# EAGLE design Nikon_PowerBoardV4 (EAGLE 7.3.0)
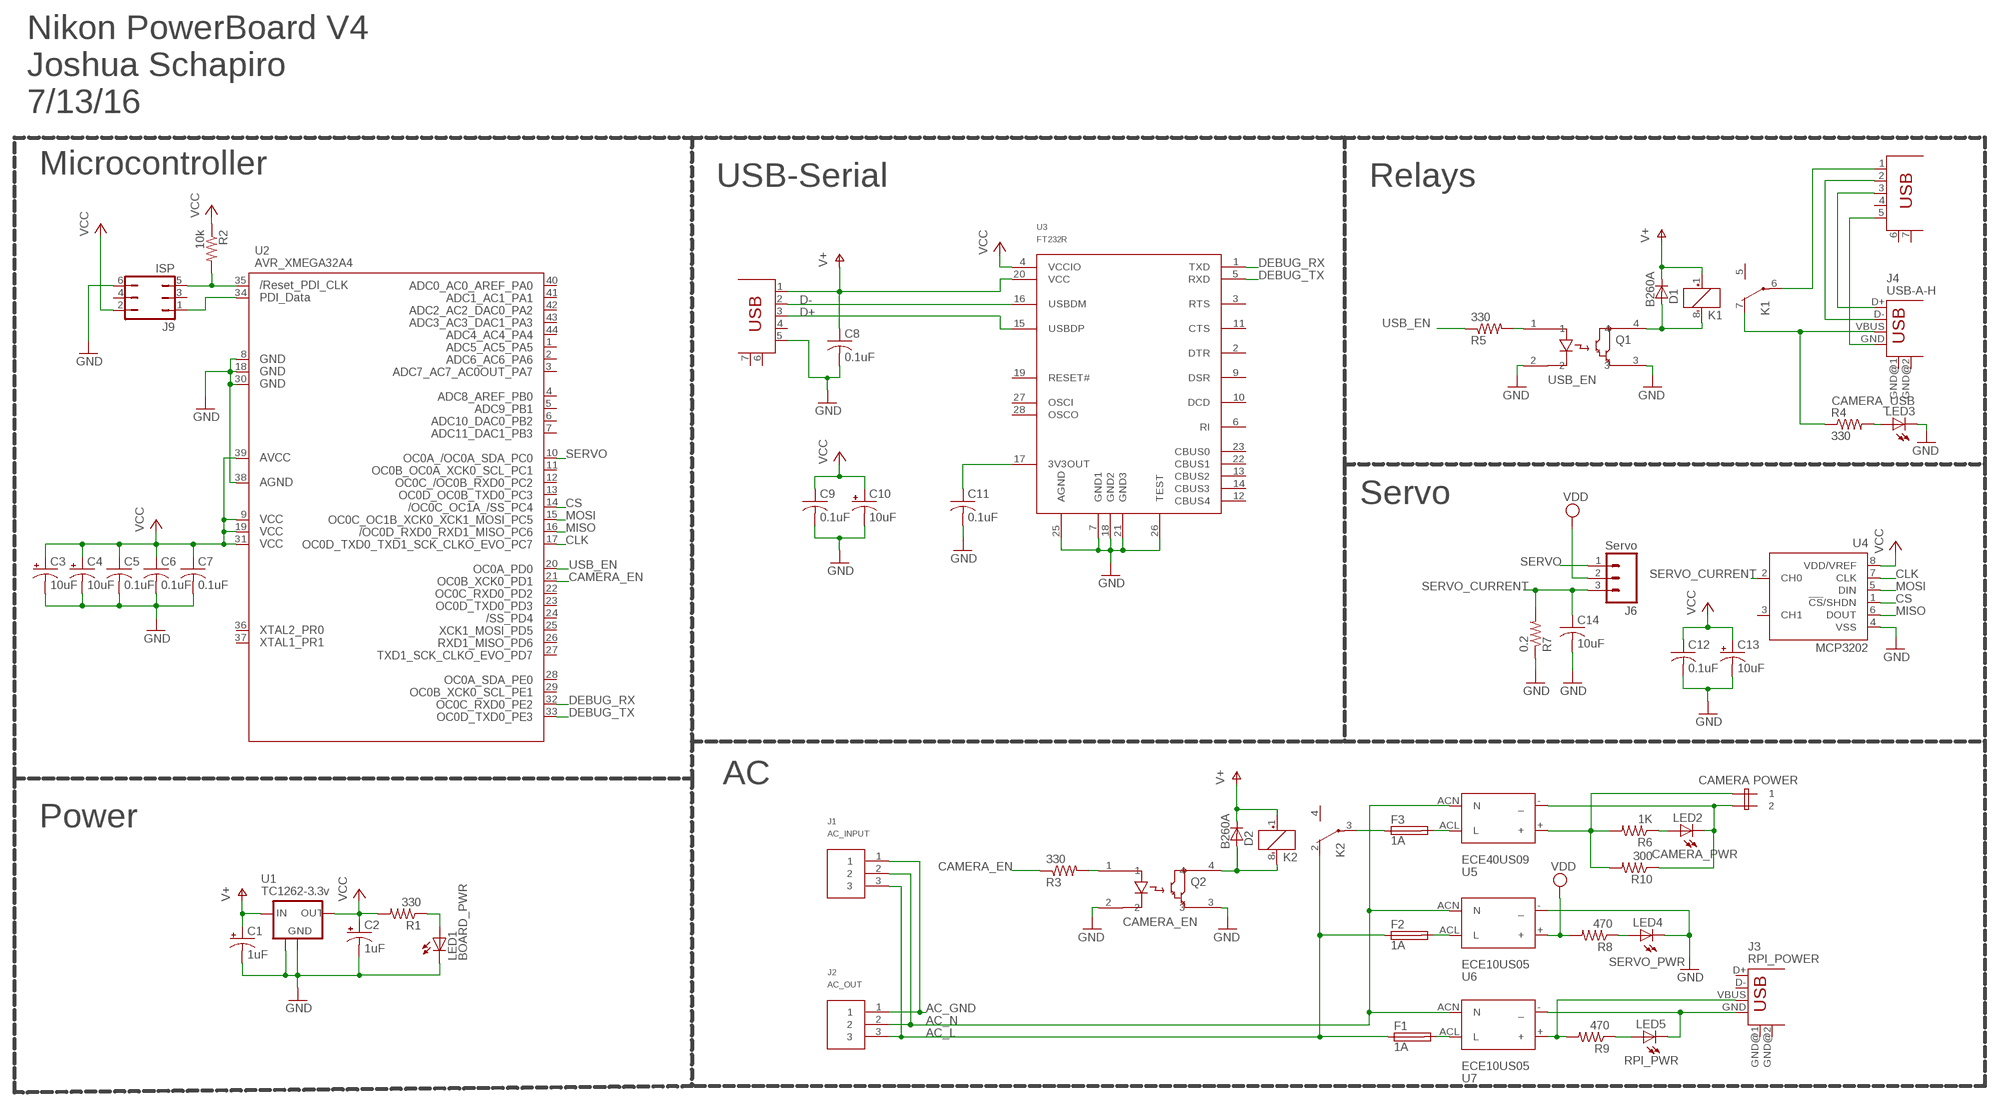
[diagram p0: schematic, sheet 1]

## Parts
C1  1uF  CAP_POL1206  [EIA3216]
C2  1uF  CAP_POL1206  [EIA3216]
C3  10uF  CAP_POL1206  [EIA3216]
C4  10uF  CAP_POL1206  [EIA3216]
C5  0.1uF  C-USC0603  [C0603]
C6  0.1uF  C-USC0603  [C0603]
C7  0.1uF  C-USC0603  [C0603]
C8  0.1uF  C-USC0603  [C0603]
C9  0.1uF  C-USC0603  [C0603]
C10  10uF  CAP_POL1206  [EIA3216]
C11  0.1uF  C-USC0603  [C0603]
C12  0.1uF  C-USC0603  [C0603]
C13  10uF  CAP_POL1206  [EIA3216]
C14  10uF  C-USC1206  [C1206]
D1  B260A  DIODESMA  [SMA-DIODE]
D2  B260A  DIODESMA  [SMA-DIODE]
F1  1A  19560  [19560]
F2  1A  19560  [19560]
F3  1A  19560  [19560]
J1  AC_INPUT  3-PIN-SCREW  [3-PIN-SCREW]
J2  AC_OUT  3-PIN-SCREW  [3-PIN-SCREW]
J3  RPI_POWER  USB-A-H  [USB-A-H]
J4  USB-A-H  [USB-A-H]
J5  CAMERA POWER  2-PIN_SCREWTERMINAL  [2-PIN_SCREWTERM]
J6  Servo  M03LONGPADS  [1X03_LONGPADS]
J7  MICRO-USB  MICRO-USBTO_SUPPORT  [MICRO_USB_SM_W/_TO_PINS]
J8  MICRO-USB  MICRO-USBTO_SUPPORT  [MICRO_USB_SM_W/_TO_PINS]
J9  ISP  JP3Q  [JP3Q]
K1  USB_EN  G6K-2F  [G6K-2F]
K2  CAMERA_EN  G6K-2F  [G6K-2F]
LED1  BOARD_PWR  LEDCHIPLED_0603  [CHIPLED_0603]
LED2  CAMERA_PWR  LEDCHIPLED_0603  [CHIPLED_0603]
LED3  CAMERA_USB  LEDCHIPLED_0603  [CHIPLED_0603]
LED4  SERVO_PWR  LEDCHIPLED_0603  [CHIPLED_0603]
LED5  RPI_PWR  LEDCHIPLED_0603  [CHIPLED_0603]
Q1  USB_EN  OPTOISOLATOR_SINGLE  [4-PIN_MINI-FLAT]
Q2  CAMERA_EN  OPTOISOLATOR_SINGLE  [4-PIN_MINI-FLAT]
R1  330  R-US_R0603  [R0603]
R2  10k  R-US_R0603  [R0603]
R3  330  R-US_R0603  [R0603]
R4  330  R-US_R0603  [R0603]
R5  330  R-US_R0603  [R0603]
R6  1K  R-US_R0603  [R0603]
R7  0.2  R-US_R1206  [R1206]
R8  470  R-US_R0603  [R0603]
R9  470  R-US_R0603  [R0603]
R10  300  R-US_R2512  [R2512]
U1  TC1262-3.3v  REGULATOR  [SOT223]
U2  AVR_XMEGA32A4  AVR_XMEGA_A4_44A  [TQFP44]
U3  FT232R  [SSOP28]
U4  MCP3202  MCP3202SN  [SO-08]
U5  ECE40US09  AC_DC_CONVERTERUS09  [EC40]
U6  ECE10US05  AC_DC_CONVERTERUS05  [ECE10]
U7  ECE10US05  AC_DC_CONVERTERUS05  [ECE10]

## Nets
AC_GND: J1.1 J2.1
AC_L: F1.1 F2.1 J1.3 J2.3 K2.2(2:O)
AC_N: J1.2 J2.2 U5.ACN(N) U6.ACN(N) U7.ACN(N)
CAMERA_EN: R3.1 U2.21(PD1)
CLK: U2.17(PC7) U4.7(CLK)
CS: U2.14(PC4) U4.1(!CS!/SHDN)
D+: J8.3(D+) U3.15(USBDP)
D-: J8.2(D-) U3.16(USBDM)
DEBUG_RX: U2.32(PE2) U3.1(TXD)
DEBUG_TX: U2.33(PE3) U3.5(RXD)
GND: C1.C(-) C2.C(-) C3.C(-) C4.C(-) C5.2 C6.2 C7.2 C8.2 C9.2 C10.C(-) C11.2 C12.2 C13.C(-) C14.2 J8.5(GND) J9.6 LED1.C LED3.C LED4.C Q1.2 Q1.3 Q2.2 Q2.3 R7.1 U1.2(GND) U1.4(GND1) U2.8(GND1) U2.18(GND2) U2.30(GND3) U2.38(AGND) U3.7(GND1) U3.18(GND2) U3.21(GND3) U3.25(AGND) U3.26(TEST) U4.4(VSS) U6.-(_)
MISO: U2.16(PC6) U4.6(DOUT)
MOSI: U2.15(PC5) U4.5(DIN)
N$1: J9.1 U2.34(PDI_DATA)
N$2: J4.GND J7.5(GND)
N$3: F3.1 K2.3(2:P)
N$4: LED1.A R1.1
N$5: Q1.1 R5.2
N$6: J9.5 R2.2 U2.35(RESET)
N$7: D2.A K2.8(1:-) Q2.4
N$8: J7.1(VBUS) K1.6(3:P)
N$10: LED3.A R4.2
N$11: Q2.1 R3.2
N$12: J3.VBUS R9.2 U7.+
N$13: F3.2 U5.ACL(L)
N$14: F2.2 U6.ACL(L)
N$15: F1.2 U7.ACL(L)
N$16: LED4.A R8.1
N$17: J5.P$1 R6.2 R10.2 U5.+
N$18: C11.1 U3.17(3V3OUT)
N$19: LED2.A R6.1
N$20: J5.P$2 LED2.C R10.1 U5.-(_)
N$21: J3.GND LED5.C U7.-(_)
N$22: LED5.A R9.1
N$23: J4.VBUS K1.7(3:O) R4.1
N$90: J4.D+ J7.3(D+)
N$100: J4.D- J7.2(D-)
N$180: D1.A K1.8(1:-) Q1.4
SERVO: J6.1 U2.10(PC0)
SERVO_CURRENT: C14.1 J6.3 R7.2 U4.2(CH0)
USB_EN: R5.1 U2.20(PD0)
V+: C1.A(+) C8.1 D1.C D2.C J8.1(VBUS) K1.1(1:+) K2.1(1:+) U1.1(IN) U3.20(VCC)
VCC: C2.A(+) C3.A(+) C4.A(+) C5.1 C6.1 C7.1 C9.1 C10.A(+) C12.1 C13.A(+) J9.2 R1.2 R2.1 U1.3(OUT) U2.9(VCC1) U2.19(VCC2) U2.31(VCC3) U2.39(AVCC) U3.4(VCCIO) U4.8(VDD/VREF)
VDD: J6.2 R8.2 U6.+
Unconnected: J3.D+ J3.D- J3.GND@1(GND) J3.GND@2(GND) J4.GND@1(GND) J4.GND@2(GND) J7.4(ID) J7.6(MTN3) J7.7(MTN4) J8.4(ID) J8.6(MTN3) J8.7(MTN4) J9.3 J9.4 K1.2(2:O) K1.3(2:P) K1.4(2:S) K1.5(3:S) K2.4(2:S) K2.5(3:S) K2.6(3:P) K2.7(3:O) U2.1(PA5) U2.2(PA6) U2.3(PA7) U2.4(PB0) U2.5(PB1) U2.6(PB2) U2.7(PB3) U2.11(PC1) U2.12(PC2) U2.13(PC3) U2.22(PD2) U2.23(PD3) U2.24(PD4) U2.25(PD5) U2.26(PD6) U2.27(PD7) U2.28(PE0) U2.29(PE1) U2.36(PR0) U2.37(PR1) U2.40(PA0) U2.41(PA1) U2.42(PA2) U2.43(PA3) U2.44(PA4) U3.2(DTR) U3.3(RTS) U3.6(RI) U3.9(DSR) U3.10(DCD) U3.11(CTS) U3.12(CBUS4) U3.13(CBUS2) U3.14(CBUS3) U3.19(RESET#) U3.22(CBUS1) U3.23(CBUS0) U3.27(OSCI) U3.28(OSCO) U4.3(CH1)

## Notes on the sheet
- Nikon PowerBoard V4
  Joshua Schapiro
  7/13/16
- Microcontroller
- USB-Serial | Relays
- Servo
- AC | CAMERA POWER
- Power

## Library data of the parts
C1-C4 C10 C13 = SparkFun:CAP_POL: Capacitor Polarized These are standard SMD and PTH capacitors. Normally 10uF, 47uF, and 100uF in electrolytic and tantalum varieties. Always verify the external diameter of the through hole cap, it varies with capacity, voltage, and manufacturer. The EIA devices should be standard.
C5 = rcl:C-US: CAPACITOR, American symbol
C6-C9 C11 C12 C14 = resistor:C-US: CAPACITOR, American symbol
D1 D2 = SparkFun:DIODE: Diode These are standard reverse protection diodes and small signal diodes. SMA package can handle up to about 1A. SOD-323 can handle about 200mA. What the SOD-323 package when ordering, there are some mfgs out there that are 5-pin packages.
F1-F3 = fuse:19560: FUSE HOLDER TR5, Wickmann
J1 J2 = Josh:3-PIN-SCREW
J3 J4 = GadgetOne:USB: USB Connectors
J5 = Josh:2-PIN_SCREWTERMINAL
J6 = SparkFun:M03: Header 3 Standard 3-pin 0.1" header. Use with straight break away headers (SKU : PRT-00116), right angle break away headers (PRT-00553), swiss pins (PRT-00743), machine pins (PRT-00117), and female headers (PRT-00115). Molex polarized connector foot print use with SKU : PRT-08232 with associated crimp pins and housings.
J7 J8 = Josh:MICRO-USB
J9 = jumper:JP3Q: JUMPER
K1 K2 = relay:G6K: Low Signal Relay oeiwcsnts1.omron.com/.. D20G6K0100.pdf
LED1-LED5 = led:LED: LED OSRAM: - CHIPLED LG R971, LG N971, LY N971, LG Q971, LY Q971, LO R971, LY R971 LH N974, LH R974 LS Q976, LO Q976, LY Q976 LO Q996 - Hyper CHIPLED LW Q18S LB Q993, LB Q99A, LB R99A - SideLED LS A670, LO A670, LY A670, LG A670, LP A670 LB A673, LV A673, LT A673, LW A673 LH A674 LY A675 LS A676, LA A676, LO A676, LY A676, LW A676 LS A679, LY A679, LG A679 - Hyper Micro SIDELED® LS Y876, LA Y876, LO Y876, LY Y876 LT Y87S - SmartLED LW L88C, LW L88S LB L89C, LB L89S, LG L890 LS L89K, LO L89K, LY L89K LS L896, LA L896, LO L896, LY L896 - TOPLED LS T670, LO T670, LY T670, LG T670, LP T670 LSG T670, LSP T670, LSY T670, LOP T670, LYG T670 LG T671, LOG T671, LSG T671 LB T673, LV T673, LT T673, LW T673 LH T674 LS T676, LA T676, LO T676, LY T676, LB T676, LH T676, LSB T676, LW T676 LB T67C, LV T67C, LT T67C, LS T67K, LO T67K, LY T67K, LW E67C LS E67B, LA E67B, LO E67B, LY E67B, LB E67C, LV E67C, LT E67C LW T67C LS T679, LY T679, LG T679 LS T770, LO T770, LY T770, LG T770, LP T770 LB T773, LV T773, LT T773, LW T773 LH T774 LS E675, LA E675, LY E675, LS T675 LS T776, LA T776, LO T776, LY T776, LB T776 LHGB T686 LT T68C, LB T68C - Hyper Mini TOPLED® LB M676 - Mini TOPLED Santana® LG M470 LS M47K, LO M47K, LY M47K Source: http://www.osram.convergy.de LUXEON: - LUMILED® LXK2-PW12-R00, LXK2-PW12-S00, LXK2-PW14-U00, LXK2-PW14-V00 LXK2-PM12-R00, LXK2-PM12-S00, LXK2-PM14-U00 LXK2-PE12-Q00, LXK2-PE12-R00, LXK2-PE12-S00, LXK2-PE14-T00, LXK2-PE14-U00 LXK2-PB12-K00, LXK2-PB12-L00, LXK2-PB12-M00, LXK2-PB14-N00, LXK2-PB14-P00, LXK2-PB14-Q00 LXK2-PR12-L00, LXK2-PR12-M00, LXK2-PR14-Q00, LXK2-PR14-R00 LXK2-PD12-Q00, LXK2-PD12-R00, LXK2-PD12-S00 LXK2-PH12-R00, LXK2-PH12-S00 LXK2-PL12-P00, LXK2-PL12-Q00, LXK2-PL12-R00 Source: www.luxeon.com KINGBRIGHT: KA-3528ASYC Source: www.kingbright.com
Q1 Q2 = Josh:OPTOISOLATOR_SINGLE: Digikey: 425-2098-1-ND If = 10ma Ic = 80ma
R1-R6 R8-R10 = resistor:R-US_: RESISTOR, American symbol
R7 = rcl:R-US_: RESISTOR, American symbol
U1 = GadgetOne:REGULATOR: VOLTAGE REGULATOR, see: http://focus.ti.com/lit/ds/symlink/ua78m05.pdf
U2 = xmega:AVR_XMEGA_A4_: Device for Atmel AVR XMEGA A4 Series
U3 = gadgetry:FT232R
U4 = microchip:MCP3202: 2.7V Dual Channel 12-Bit A/D Converter with SPI Serial Interface Source: http://ww1.microchip.com/downloads/en/DeviceDoc/21034D.pdf
U5-U7 = Josh:AC_DC_CONVERTER

## Net classes
4 xxwide: width 0.203 mm

## Board
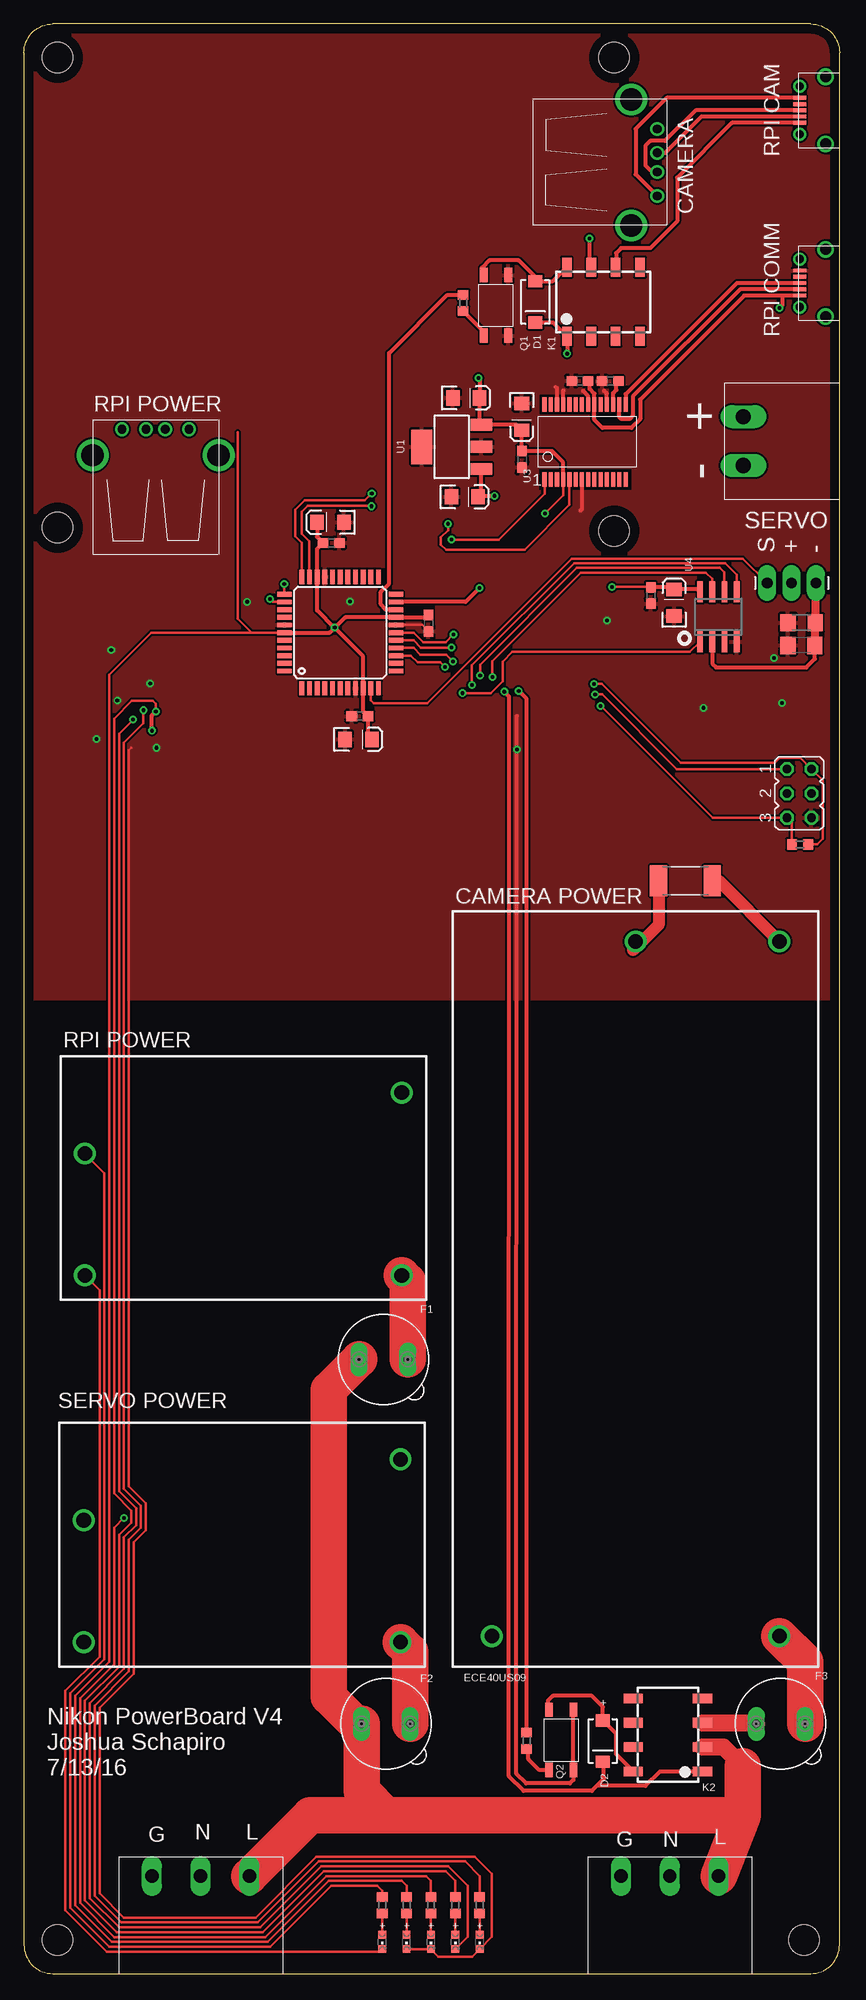
[diagram p1: board, top side]
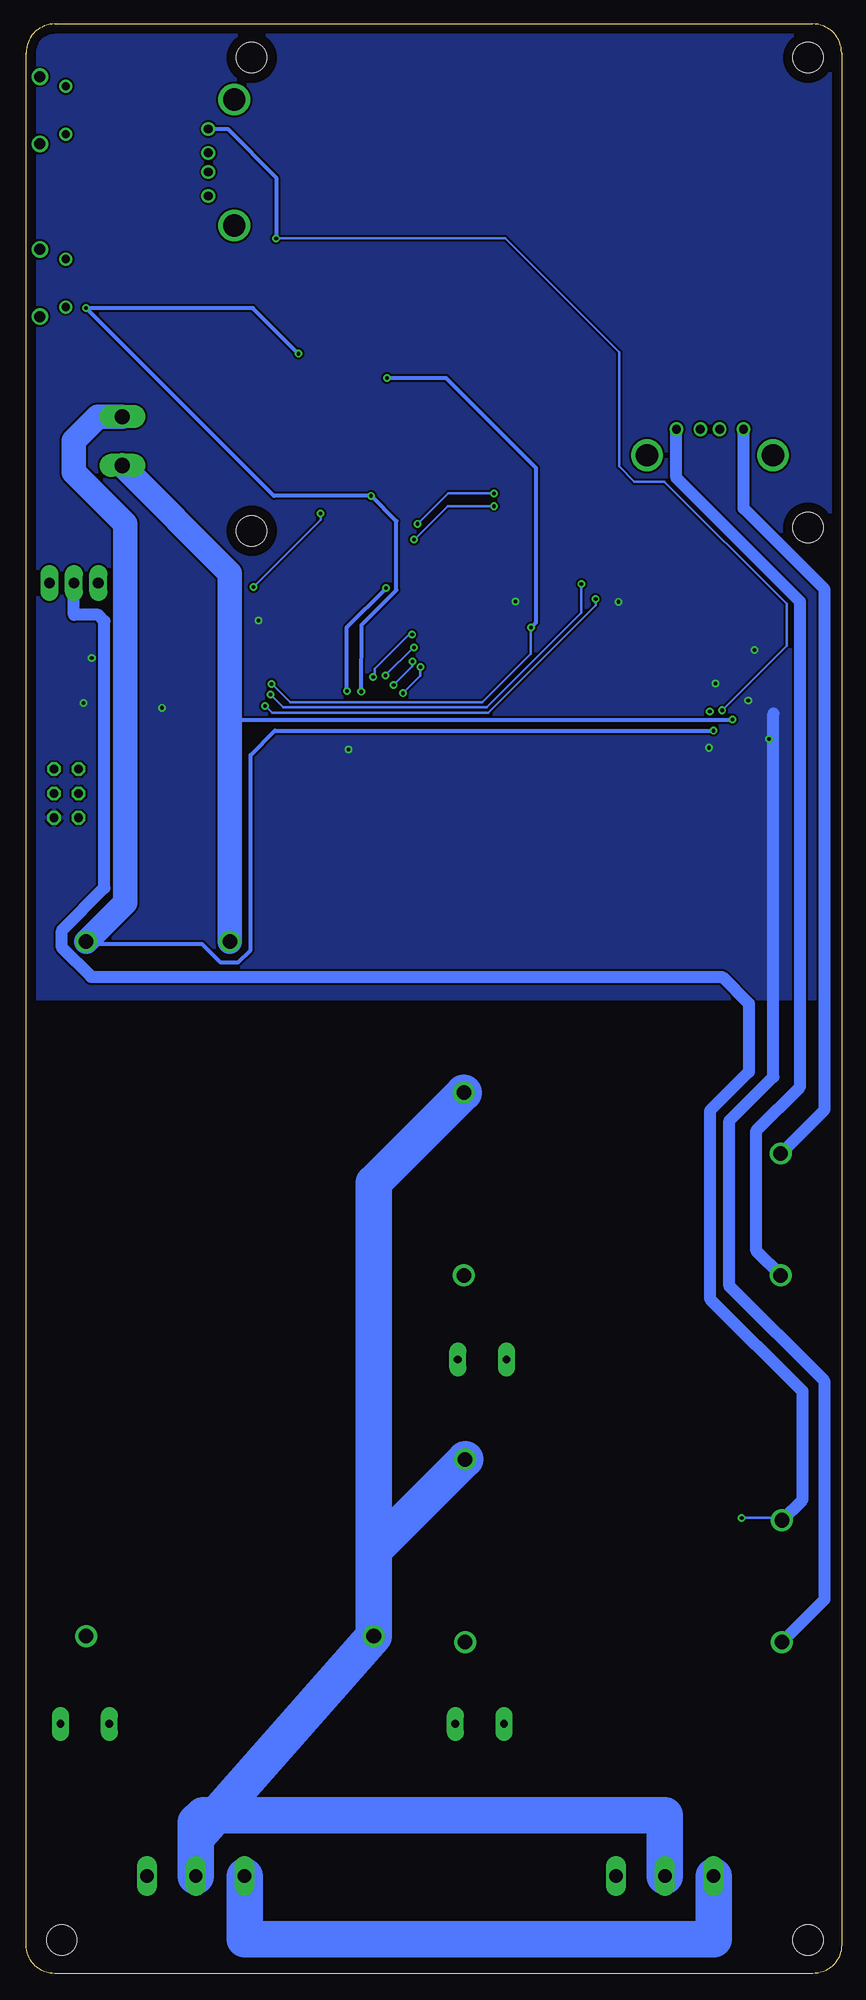
[diagram p2: board, bottom side, seen from below]

Size 85 x 203.2 mm. Coordinates in mm from the lower left corner, seen from the top.
Outline: 3,0 82,0 arc90 85,3 85,200.2 arc90 82,203.2 3,203.2 arc90 0,200.2 0,3 arc90 3,0
Copper layers (1*16): Top 0.035mm / dielectric 1.5mm / Bottom 0.035mm
Design rules "default *": minimum track width 6mil, minimum drill 15mil, track to track 8mil, track to pad 8mil, pad to pad 8mil, via to via 8mil, smd to smd 8mil, copper to edge 40mil, drill to drill 8mil, minimum pad ring 10mil, minimum via ring 8mil, stop-mask expansion 4mil, vias tented up to drill 0mil, thermal gap 10mil
Holes 3.17 mm at 3.5,199.7 61.5,150.38 3.5,150.7 61.5,199.7 3.5,3.5 81.28,3.5
tRestrict: area 53.7,162.5 to 63.2,164.6; area 53.7,154.6 to 63.3,156.8

### Footprints (pad centres in the part's own frame; a part is rotated, then mirrored left to right if it is on the bottom)
EIA3216 = smd 1.4 x 1.6: A 1.4,0; C -1.4,0
C0603 = smd 1.1 x 1: 1 -0.85,0; 2 0.85,0
C1206 = smd 1.6 x 1.8: 1 -1.4,0; 2 1.4,0
SMA-DIODE = smd 1.27 x 1.47: A -2.15,0; C 2.15,0
19560 = drill 0.813 pad 1.778 long: 1 -2.54,0; 2 2.54,0
3-PIN-SCREW = drill 1.397 long: 1 -5.08,10.16; 2 0,10.16; 3 5.08,10.16
USB-A-H = drill 0.914: D+ 2.718,-1.003; D- 2.718,1.003; GND 2.718,-3.493; VBUS 2.718,3.493 | drill 2.311: GND@1 0,6.566; GND@2 0,-6.566
2-PIN_SCREWTERM = drill 1.6 long: P$1 -2.54,0; P$2 2.54,0
1X03_LONGPADS = drill 1.118 pad 1.88 long: 1 0,0; 2 2.54,0; 3 5.08,0
MICRO_USB_SM_W/_TO_PINS = smd 0.4 x 1.35: 1 -1.3,4.15; 2 -0.65,4.15; 3 0,4.15; 4 0.65,4.15; 5 1.3,4.15 | drill 1.15: 6 -3.5,1.45; 7 3.5,1.45 | drill 0.85: P$1 -2.5,4.15; P$2 2.5,4.15
JP3Q = drill 0.914 octagon: 1 -2.54,-1.27; 2 -2.54,1.27; 3 0,-1.27; 4 0,1.27; 5 2.54,-1.27; 6 2.54,1.27
G6K-2F = smd 1 x 2: 1 -3.81,-3.6; 2 -1.27,-3.6; 3 1.27,-3.6; 4 3.81,-3.6; 5 3.81,3.6; 6 1.27,3.6; 7 -1.27,3.6; 8 -3.81,3.6
CHIPLED_0603 = smd 0.8 x 0.8: A 0,-0.75; C 0,0.75
4-PIN_MINI-FLAT = smd 1.5 x 0.8: 1 -3.15,1.27; 2 -3.15,-1.27; 3 3.15,-1.27; 4 3.15,1.27
R0603 = smd 1 x 1.1: 1 -0.85,0; 2 0.85,0
R1206 = smd 1.6 x 1.803: 1 -1.422,0; 2 1.422,0
R2512 = smd 1.8 x 3.2: 1 -2.8,0; 2 2.8,0
SOT223 = smd 1.219 x 2.235: 1 -2.311,-3.099; 2 0,-3.099; 3 2.311,-3.099 | smd 3.6 x 2.2: 4 0,3.099
TQFP44 = smd 1.5 x 0.5: 1 -5.8,4; 2 -5.8,3.2; 3 -5.8,2.4; 4 -5.8,1.6; 5 -5.8,0.8; 6 -5.8,0; 7 -5.8,-0.8; 8 -5.8,-1.6; 9 -5.8,-2.4; 10 -5.8,-3.2; 11 -5.8,-4; 23 5.8,-4; 24 5.8,-3.2; 25 5.8,-2.4; 26 5.8,-1.6; 27 5.8,-0.8; 28 5.8,0; 29 5.8,0.8; 30 5.8,1.6; 31 5.8,2.4; 32 5.8,3.2; 33 5.8,4 | smd 0.5 x 1.5: 12 -4,-5.8; 13 -3.2,-5.8; 14 -2.4,-5.8; 15 -1.6,-5.8; 16 -0.8,-5.8; 17 0,-5.8; 18 0.8,-5.8; 19 1.6,-5.8; 20 2.4,-5.8; 21 3.2,-5.8; 22 4,-5.8; 34 4,5.8; 35 3.2,5.8; 36 2.4,5.8; 37 1.6,5.8; 38 0.8,5.8; 39 0,5.8; 40 -0.8,5.8; 41 -1.6,5.8; 42 -2.4,5.8; 43 -3.2,5.8; 44 -4,5.8
SSOP28 = smd 0.425 x 1.5: 1 0.65,-1.3; 2 1.3,-1.3; 3 1.95,-1.3; 4 2.6,-1.3; 5 3.25,-1.3; 6 3.9,-1.3; 7 4.55,-1.3; 8 5.2,-1.3; 9 5.85,-1.3; 10 6.5,-1.3; 11 7.15,-1.3; 12 7.8,-1.3; 13 8.45,-1.3; 14 9.1,-1.3; 15 9.1,6.5; 16 8.45,6.5; 17 7.8,6.5; 18 7.15,6.5; 19 6.5,6.5; 20 5.85,6.5; 21 5.2,6.5; 22 4.55,6.5; 23 3.9,6.5; 24 3.25,6.5; 25 2.6,6.5; 26 1.95,6.5; 27 1.3,6.5; 28 0.65,6.5
SO-08 = smd 0.6 x 2.2: 1 -1.905,-2.6; 2 -0.635,-2.6; 3 0.635,-2.6; 4 1.905,-2.6; 5 1.905,2.6; 6 0.635,2.6; 7 -0.635,2.6; 8 -1.905,2.6
EC40 = drill 1.524: + 36.195,-14.986; - 36.195,0; ACL -36.195,-14.986; ACN -36.195,14.986
ECE10 = drill 1.524: + 16.51,-2.54; - 16.51,10.16; ACL -16.51,10.16; ACN -16.51,-8.89

### Placement (x,y rotation side)
C1  45.94,153.92 0 top
C2  46.09,164.23 0 top
C3  34.86,128.64 0 top
C4  31.94,151.27 180 top
C5  42.15,140.75 270 top
C6  32.02,149.11 0 top
C7  35.01,131.05 180 top
C8  57.95,166 180 top
C9  51.91,157.83 270 top
C10  51.88,162.25 270 top
C11  61.1,165.98 180 top
C12  65.34,143.64 270 top
C13  67.76,142.87 90 top
C14  81.03,138.43 180 top
D1  53.28,174.24 270 top
D2  60.33,24.23 270 top
F1  37.47,64.01 0 top
F2  37.72,26.04 0 top
F3  78.87,26.04 0 top
J1  67.31,0 0 top
J2  18.41,0 0 top
J3  13.72,158.24 90 top
J4  63.29,188.77 0 top
J5  74.97,159.73 270 top
J6  77.47,144.94 0 top
J7  85,194.2 90 top
J8  85,176.2 90 top
J9  80.81,123 270 top
K1  60.4,174.24 0 top
K2  67.11,24.87 90 top
LED1  39.88,3.3 180 top
LED2  44.96,3.3 180 top
LED3  47.5,3.3 180 top
LED4  42.42,3.3 180 top
LED5  37.34,3.3 180 top
Q1  49.2,173.87 90 top
Q2  56,24.35 90 top
R1  39.88,7.11 90 top
R2  80.89,117.69 180 top
R3  52.39,24.27 270 top
R4  47.5,7.11 270 top
R5  45.78,174.12 270 top
R6  44.96,7.11 90 top
R7  81.05,140.8 0 top
R8  42.42,7.11 90 top
R9  37.34,7.11 90 top
R10  68.94,113.89 0 top
U1  44.57,159.13 90 top
U2  32.96,139.76 90 top
U3  53.61,157.02 0 top
U4  72.37,141.41 0 top
U5  63.75,71.37 90 top
U6  22.73,44.7 180 top
U7  22.86,82.93 180 top

### Tracks (layer width: path | path; a pad name or v marks a point on that pad's centre or on a via)
AC_GND
  Bottom 3.81: J1.1 62.23,3.56 13.34,3.56 J2.1
AC_L
  Top 1.778: 74.93,21.59 72.92,23.6 K2.2
  Top 3.81: J1.3 74.93,16.51 | 74.93,16.51 37.72,16.51 | 74.93,16.51 74.93,21.59 | F2.1 35.18,25.4 | 35.18,25.4 35.18,19.05 37.72,16.51 | F1.1 31.75,60.83 31.75,28.83 35.18,25.4 | J2.3 29.84,16.51 37.72,16.51
AC_N
  Bottom 3.81: J2.2 18.41,16.51 66.55,16.51 67.31,15.75 J1.2 67.31,14.1 U5.ACN | U6.ACN 48.77,44.07 U5.ACN | U7.ACN 48.77,82.42 U5.ACN
CAMERA_EN  (via drill 0.38)
  Top 0.406: R3.1 52.39,132.85 v51.56,133.68 | v47.47,144.4 46.04,142.96 U2.21
  Bottom 0.406: v51.56,133.68 51.56,140.31 v47.47,144.4
CLK  (via drill 0.38)
  Top 0.254: U4.7 71.74,145.36 71.07,146.03 58.04,146.03 48.82,136.8 v48.82,135.15 | U2.17 40.63,139.76 41.63,138.76 43.94,138.76 v44.76,139.57
  Bottom 0.254: v44.76,139.57 45.09,139.57 48.64,136.02 48.64,135.33 v48.82,135.15
CS  (via drill 0.38)
  Top 0.254: U2.14 40.31,137.36 41.02,136.65 43.41,136.65 v43.89,136.17 | v45.72,133.45 48.64,133.45 49.89,134.7 49.89,136.75 50.88,137.74 69.4,137.74 U4.1
  Bottom 0.254: v43.89,136.17 43.89,135.28 v45.72,133.45
D+
  Top 0.406: J8.3 74.3,176.2 62.7,164.61 U3.15
D-
  Top 0.406: J8.2 74.64,175.55 63.48,164.39 63.48,162.38 63.12,162.03 62.26,162.03 62.05,162.23 U3.16
DEBUG_RX  (via drill 0.38)
  Top 0.254: U2.32 29.76,149.29 28.96,150.09 28.96,152.38 29.57,152.98 36.17,152.98 v36.22,152.93 | v44.55,149.45 49.48,149.45 54.26,154.23 U3.1
  Bottom 0.254: v36.22,152.93 41.07,152.93 v44.55,149.45
DEBUG_TX  (via drill 0.38)
  Top 0.254: U2.33 28.96,149.15 28.3,149.81 28.3,152.55 29.29,153.54 35.51,153.54 v36.25,154.28 | v44.2,151.1 44.2,150.42 43.46,149.68 43.46,148.95 43.99,148.41 52.17,148.41 56.85,153.1 U3.5
  Bottom 0.254: v36.25,154.28 41.02,154.28 v44.2,151.1
GND  (via drill 0.38)
  Top 0.254: LED1.C LED4.C 43.18,1.78 46.72,1.78 LED3.C 48.77,3.82 48.77,10.41 46.99,12.19 30.48,12.19 24.13,5.84 10.41,5.84 7.87,8.38 7.87,27.69 11.43,31.24 11.43,44.96 12.7,46.23 12.7,49.02 10.92,50.8 10.92,127.51 11.18,127.76 | U2.18 41.49,140.56 C5.2
  Top 0.406: Q2.3 Q2.2 57.27,20.19 56.9,19.81 52.32,19.81 51.31,20.83 51.38,131.09 | U3.18 60.76,164.69 60.45,165 | U3.26 55.55,165.22 55.4,165.38 | U3.25 56.2,164.99 56.24,165.02 | U3.21 58.8,164.41 58.27,164.95 | U3.7 58.16,152.64 57.99,152.48
  Bottom 1.27: U6.- 1.78,38.99 1.78,61.72 11.68,71.63 11.68,88.9 7.11,93.47 7.11,131.32
  other vias: 13.82,127.76 7.57,128.68 13.16,134.47 23.27,142.98 33.99,143 9.09,137.95 9.73,132.69 51.38,127.58 60.76,141.02 70.84,131.93 79.02,132.44 78.16,137.11
  pour Bottom: 0,101.6 85,101.6 85,203.2 0,203.2
  pour Top: 0,203.2 85,203.2 85,101.6 0,101.6
MISO  (via drill 0.38)
  Top 0.254: U4.6 73.01,146.04 72.54,146.51 57.63,146.51 47.55,136.42 v47.55,135.31 | U2.16 40.62,138.96 41.38,138.2 v44.55,138.2
  Bottom 0.254: v47.55,135.31 44.65,138.2 v44.55,138.2
MOSI  (via drill 0.38)
  Top 0.254: U4.5 74.28,145.81 73.1,146.99 57.33,146.99 46.69,136.35 v46.69,134.31 | U2.15 40.63,138.16 41.33,137.47 44.02,137.47 v44.73,136.75
  Bottom 0.254: v46.69,134.31 44.73,136.27 v44.73,136.75
N$1  (via drill 0.38)
  Top 0.254: U2.34 27.13,143.79 v27.13,144.83 | v59.54,133.32 60.25,133.32 68.03,125.54 J9.1
  Bottom 0.254: v27.13,144.83 27.13,141.86 37.01,131.98 58.19,131.98 v59.54,133.32
N$2
  Top 0.406: J7.5 66.98,195.5 63.75,192.28 63.75,187.53 J4.GND
N$3
  Top 1.778: K2.3 76.22,26.14 F3.1
N$4
  Top 0.254: R1.1 LED1.A
N$5
  Top 0.406: Q1.1 47.93,171.12 R5.2
N$6  (via drill 0.38)
  Top 0.254: R2.2 80.04,119.96 J9.5 71.77,120.46 v60.1,132.13 | U2.35 25.92,142.96 v25.63,143.26
  Bottom 0.254: v25.63,143.26 25.63,142.6 36.83,131.39 59.36,131.39 v60.1,132.13
N$7
  Top 0.406: K2.8 61.72,22.86 61.72,24.98 D2.A 60.33,27.81 59.18,28.96 55.12,28.96 54.61,28.45 54.61,27.62 Q2.4
N$8
  Top 0.406: J7.1 73.77,192.9 68.07,187.2 68.07,182.63 65.28,179.83 62.23,179.83 61.72,179.32 61.72,177.9 K1.6
N$10
  Top 0.254: R4.2 LED3.A
N$11
  Top 0.406: Q2.1 53.73,21.2 52.58,22.35 52.58,23.24 R3.2
N$12
  Top 0.254: R9.2 37.34,8.64 36.83,9.14 32,9.14 25.65,2.79 8.89,2.79 4.83,6.86 4.83,29.21 8.38,32.77 8.38,83.44 U7.+
  Bottom 1.27: U7.+ 1.78,90.04 1.78,144.27 10.22,152.72 J3.VBUS
N$13
  Top 3.81: F3.2 81.41,32.51 U5.ACL
N$14
  Top 3.81: F2.2 40.26,33.53 U6.ACL
N$15
  Top 3.81: F1.2 40.01,72.14 U7.ACL
N$16
  Top 0.254: R8.1 LED4.A
N$17  (via drill 0.38)
  Top 0.254: R6.2 44.96,9.65 43.94,10.67 31.24,10.67 24.89,4.32 9.65,4.32 6.35,7.62 6.35,28.45 9.91,32 9.91,45.72 11.18,46.99 11.18,48.26 9.4,50.04 9.4,130.81 11.25,132.66 13.41,132.66 13.74,132.33 v13.74,131.55
  Top 0.406: v13.34,129.54 13.34,131.14 v13.74,131.55
  Top 1.27: R10.2 72.42,113.89 U5.+
  Bottom 0.406: v13.34,129.54 59.05,129.54 61.59,127 61.59,106.68 62.87,105.41 64.77,105.41 66.67,107.31 78.49,107.31 U5.+
  Bottom 2.54: U5.+ 74.68,111.63 74.68,151.13 80.01,156.46 80.01,159.77 77.51,162.27 J5.P$1
N$18
  Top 0.406: U3.17 61.41,164.73 61.75,165.07 61.75,165.78 C11.1
N$19
  Top 0.254: R6.1 LED2.A
N$20  (via drill 0.38)
  Top 0.254: LED2.C 46.23,3.82 46.23,9.14 44.2,11.18 30.99,11.18 24.64,4.83 9.91,4.83 6.86,7.87 6.86,28.19 10.41,31.75 10.41,45.47 11.68,46.74 11.68,48.51 9.91,50.29 9.91,129.24 v11.38,130.71
  Top 1.27: R10.1 66.14,109.32 63.5,106.68 63.5,107.31 U5.-
  Bottom 0.406: v11.38,130.71 63.75,130.71 63.75,131.44
  Bottom 2.54: J5.P$2 63.75,145.97 63.75,131.44 U5.-
N$21
  Top 0.254: LED5.C 37.07,2.29 8.64,2.29 4.32,6.6 4.32,29.46 7.87,33.02 7.87,71.25 U7.-
  Bottom 1.27: U7.- 8.89,75.31 8.89,87.88 4.32,92.46 4.32,143 17.21,155.89 J3.GND
N$22
  Top 0.254: R9.1 LED5.A
N$23  (via drill 0.38)
  Top 0.254: R4.1 47.5,10.16 45.97,11.68 30.73,11.68 24.38,5.33 10.16,5.33 7.37,8.13 7.37,27.94 10.92,31.5 10.92,45.21 12.19,46.48 12.19,48.77 10.41,50.55 10.41,128.27 12.45,130.3 v12.45,131.67
  Top 0.406: v58.93,180.85 58.93,178.04 K1.7
  Bottom 0.254: v12.45,131.67 5.71,138.41 5.71,142.75 18.47,155.5 21.59,155.5 23.19,157.1 23.19,168.96 35.08,180.85 v58.93,180.85
  Bottom 0.406: J4.VBUS 63.99,192.26 58.93,187.2 v58.93,180.85
N$90
  Top 0.406: J7.3 69.99,194.2 66.8,191.01 65.28,191.01 64.77,190.5 64.77,188.47 65.28,187.96 65.81,187.96 J4.D+
N$100
  Top 0.406: J7.2 70.61,193.55 66.8,189.74 66.04,189.74 J4.D-
N$180
  Top 0.406: K1.8 55.14,176.39 D1.A 53.28,176.84 51.56,178.56 48.51,178.56 47.75,177.8 47.75,177.2 Q1.4
SERVO
  Top 0.254: U2.10 36.16,132.7 36.45,132.41 42.01,132.41 57.07,147.47 74.94,147.47 J6.1
SERVO_CURRENT
  Top 0.406: U4.2 71.74,136.54 72.14,136.14 81.53,136.14 82.43,137.04 C14.1
  Top 0.813: J6.3 82.55,140.88 R7.2 82.47,138.47 C14.1
USB_EN
  Top 0.406: U2.20 37.72,142.16 37.19,142.7 37.19,144.02 38.05,144.88 38.05,168.88 44.13,174.97 R5.1
V+  (via drill 0.38)
  Top 0.406: K2.1 66.27,21.06 64.77,19.56 59.69,19.56 | D2.C 60.45,21.95 60.45,20.32 59.69,19.56 | 59.69,19.56 59.18,19.05 52.07,19.05 50.55,20.57 50.57,133.1 v50.06,133.6 | D1.C 55.14,172.09 K1.1 56.62,170.61 v56.62,168.83 | C8.1 58.95,165.85 58.95,165.18 59.45,164.67 U3.20 59.45,161.93 60.27,161.11 63.3,161.11 64.21,162.03 64.21,164.06 75.05,174.9 79.07,174.9 | J8.1 79.07,174.9 | v78.74,173.58 79.07,173.91 79.07,174.9 | U1.1 47.67,154.25 C1.A 47.45,154.03 v49.05,154.03
  Bottom 0.406: v56.62,168.83 61.37,173.58 v78.74,173.58 59.18,154.03 v49.05,154.03 46.41,151.38 46.41,144.2 50.04,140.56 v50.06,133.6
VCC  (via drill 0.38)
  Top 0.254: R1.2 39.88,9.14 39.37,9.65 31.75,9.65 25.4,3.3 9.14,3.3 5.33,7.11 5.33,28.96 8.89,32.51 8.89,135.38 13.27,139.76 23.75,139.76 | 23.75,139.76 U2.39 | R2.1 82.66,117.69 83.24,118.26 83.24,124.38 J9.2 80.9,126.72 78.77,126.72 78.23,126.19 68.45,126.19 60.22,134.42 v59.41,134.42 | 22.3,160.63 22.3,141.21 23.75,139.76 | C12.1 65.3,144.53 v61.29,144.53 | v54.3,152.2 56.2,154.1 U3.4
  Top 0.406: U4.8 70.2,144.27 C13.A 67.55,144.49 C12.1 | U3.4 56.2,157.51 55.04,158.68 C9.1 51.88,158.7 C10.A 51.3,161.44 U1.3 47.49,161.61 C2.A 47.49,166.17 v47.37,166.29 | C3.A 35.86,129.03 C7.1 35.36,131.56 U2.9 35.36,137.29 32.38,140.26 v32.38,140.28 | C5.1 41.91,141.36 U2.19 33.49,141.36 32.41,140.28 v32.38,140.28 | C4.A 30.54,149.74 C6.1 30.56,148.5 U2.31 30.56,142.09 32.36,140.28 v32.38,140.28 | U2.39 31.86,139.76 v32.38,140.28
  Bottom 0.254: v61.29,144.53 54.3,151.51 v54.3,152.2 | v59.41,134.42 57.48,132.49 37.44,132.49 32.38,137.54 v32.38,140.28
  Bottom 0.406: v32.38,140.28 31.83,140.84 31.83,156.9 41.22,166.29 v47.37,166.29
VDD  (via drill 0.38)
  Top 0.254: R8.2 42.42,9.65 41.91,10.16 31.5,10.16 25.15,3.81 9.4,3.81 5.84,7.37 5.84,28.7 9.4,32.26 9.4,46.48 v10.41,47.5
  Bottom 0.254: v10.41,47.5 6.48,47.5 U6.+
  Bottom 1.27: U6.+ 4.06,49.4 4.06,60.71 13.72,70.36 13.72,89.92 9.65,93.98 9.65,101.09 12.45,103.89 78.23,103.89 81.28,106.93 81.28,108.71 76.83,113.16 76.83,140.97 77.47,141.6 80.01,141.6 80.01,141.61 J6.2

### Text on the board
tPlace: SERVO | S | + | - | CAMERA POWER | RPI POWER | SERVO POWER | G | N | L | G | N | L
tNames: CAMERA | RPI CAM | RPI COMM | RPI POWER | + | - | + | Nikon PowerBoard V4 / Joshua Schapiro / 7/13/16 | + | + | + | + | +